# Altium project Proto_buttons.PrjPcb
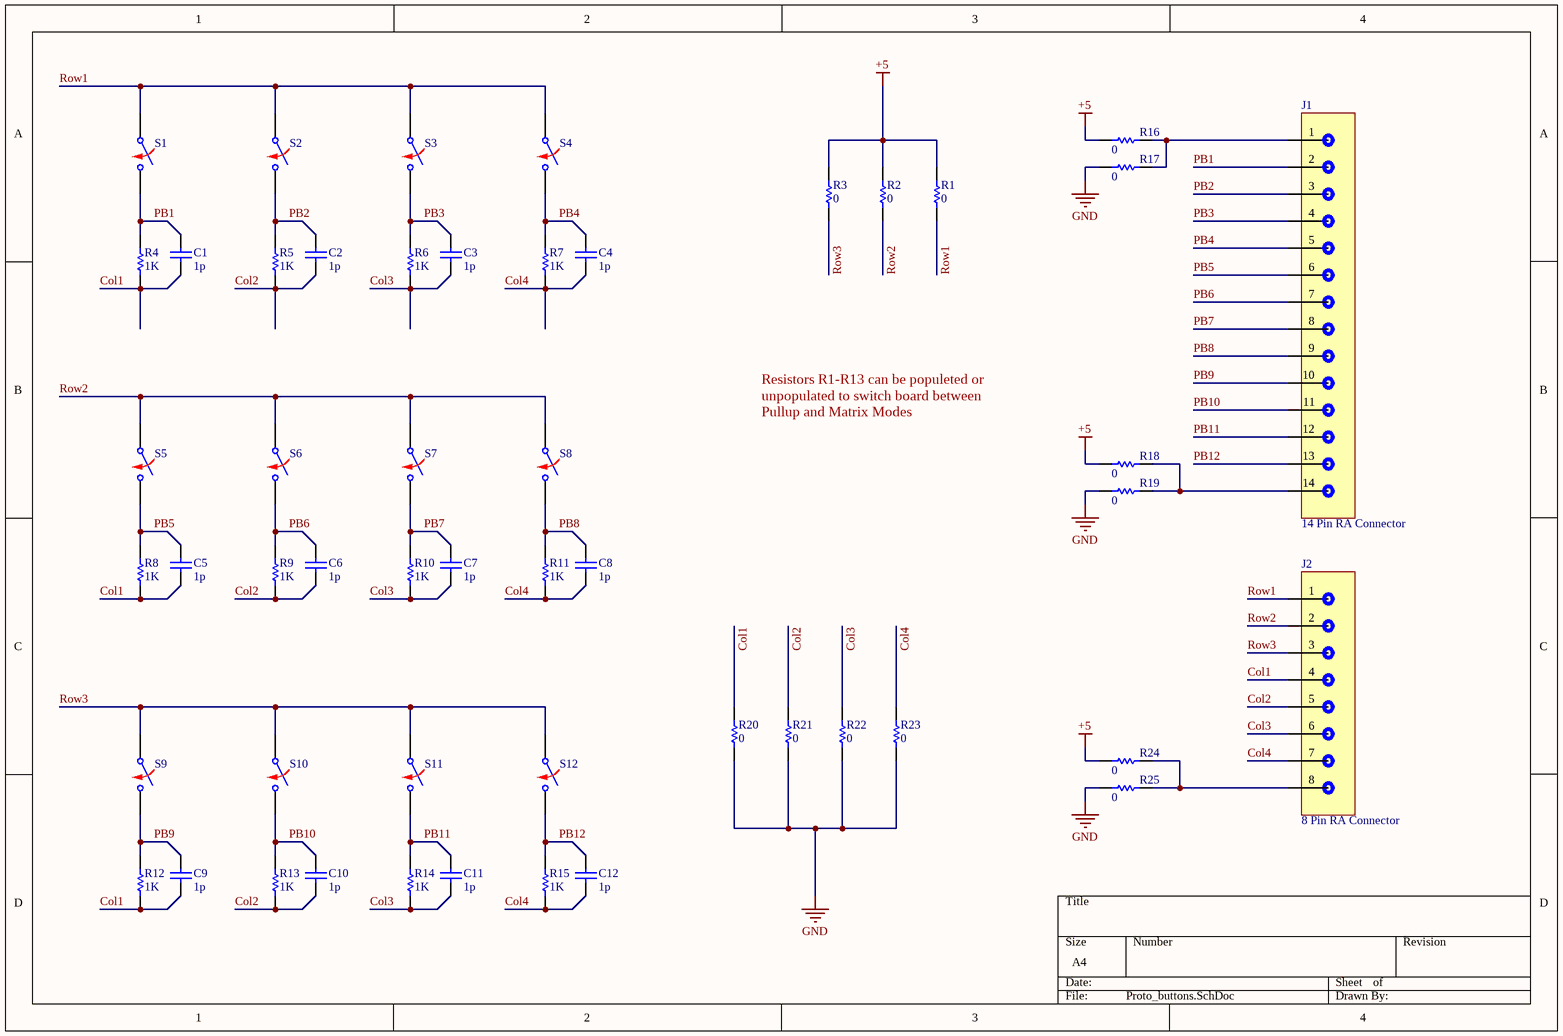
[diagram p0: Proto_buttons.SchDoc]
1 sheet, 51 parts. Net scope: global (net labels, ports and power ports of the same name join across sheets).
Board file: Proto_buttons.PcbDoc

## Sheet Proto_buttons.SchDoc
size A4; SheetNumber: 1; SheetTotal: 1

### Parts
C1  value 1p  [TDK_CC0603_N]  (hidden comment: Capacitor)
C2  value 1p  [TDK_CC0603_N]  (hidden comment: Capacitor)
C3  value 1p  [TDK_CC0603_N]  (hidden comment: Capacitor)
C4  value 1p  [TDK_CC0603_N]  (hidden comment: Capacitor)
C5  value 1p  [TDK_CC0603_N]  (hidden comment: Capacitor)
C6  value 1p  [TDK_CC0603_N]  (hidden comment: Capacitor)
C7  value 1p  [TDK_CC0603_N]  (hidden comment: Capacitor)
C8  value 1p  [TDK_CC0603_N]  (hidden comment: Capacitor)
C9  value 1p  [TDK_CC0603_N]  (hidden comment: Capacitor)
C10  value 1p  [TDK_CC0603_N]  (hidden comment: Capacitor)
C11  value 1p  [TDK_CC0603_N]  (hidden comment: Capacitor)
C12  value 1p  [TDK_CC0603_N]  (hidden comment: Capacitor)
J1  14 Pin RA Connector  [14pin-Edge Connector]
J2  8 Pin RA Connector  [8pin-Edge Connector]
R1  value 0  [Yageo_0603]  (hidden comment: Resistor)
R2  value 0  [Yageo_0603]  (hidden comment: Resistor)
R3  value 0  [Yageo_0603]  (hidden comment: Resistor)
R4  value 1K  [Yageo_0603]  (hidden comment: Resistor)
R5  value 1K  [Yageo_0603]  (hidden comment: Resistor)
R6  value 1K  [Yageo_0603]  (hidden comment: Resistor)
R7  value 1K  [Yageo_0603]  (hidden comment: Resistor)
R8  value 1K  [Yageo_0603]  (hidden comment: Resistor)
R9  value 1K  [Yageo_0603]  (hidden comment: Resistor)
R10  value 1K  [Yageo_0603]  (hidden comment: Resistor)
R11  value 1K  [Yageo_0603]  (hidden comment: Resistor)
R12  value 1K  [Yageo_0603]  (hidden comment: Resistor)
R13  value 1K  [Yageo_0603]  (hidden comment: Resistor)
R14  value 1K  [Yageo_0603]  (hidden comment: Resistor)
R15  value 1K  [Yageo_0603]  (hidden comment: Resistor)
R16  value 0  [Yageo_0603]  (hidden comment: Resistor)
R17  value 0  [Yageo_0603]  (hidden comment: Resistor)
R18  value 0  [Yageo_0603]  (hidden comment: Resistor)
R19  value 0  [Yageo_0603]  (hidden comment: Resistor)
R20  value 0  [Yageo_0603]  (hidden comment: Resistor)
R21  value 0  [Yageo_0603]  (hidden comment: Resistor)
R22  value 0  [Yageo_0603]  (hidden comment: Resistor)
R23  value 0  [Yageo_0603]  (hidden comment: Resistor)
R24  value 0  [Yageo_0603]  (hidden comment: Resistor)
R25  value 0  [Yageo_0603]  (hidden comment: Resistor)
S1  Switch Normally Opened  [SW_SWT0310-043016GSA_REVA]  (value not drawn)
S2  Switch Normally Opened  [SW_SWT0310-043016GSA_REVA]  (value not drawn)
S3  Switch Normally Opened  [SW_SWT0310-043016GSA_REVA]  (value not drawn)
S4  Switch Normally Opened  [SW_SWT0310-043016GSA_REVA]  (value not drawn)
S5  Switch Normally Opened  [SW_SWT0310-043016GSA_REVA]  (value not drawn)
S6  Switch Normally Opened  [SW_SWT0310-043016GSA_REVA]  (value not drawn)
S7  Switch Normally Opened  [SW_SWT0310-043016GSA_REVA]  (value not drawn)
S8  Switch Normally Opened  [SW_SWT0310-043016GSA_REVA]  (value not drawn)
S9  Switch Normally Opened  [SW_SWT0310-043016GSA_REVA]  (value not drawn)
S10  Switch Normally Opened  [SW_SWT0310-043016GSA_REVA]  (value not drawn)
S11  Switch Normally Opened  [SW_SWT0310-043016GSA_REVA]  (value not drawn)
S12  Switch Normally Opened  [SW_SWT0310-043016GSA_REVA]  (value not drawn)

### Nets
+5: R1.1 R2.1 R3.1 R16.2 R18.1 R24.1
GND: R17.1 R19.1 R20.2 R21.2 R22.2 R23.2 R25.1
Col1: C1.1 C5.1 C9.1 J2.4 R4.2 R8.2 R12.2 R20.1
Col2: C2.1 C6.1 C10.1 J2.5 R5.2 R9.2 R13.2 R21.1
Col3: C3.1 C7.1 C11.1 J2.6 R6.2 R10.2 R14.2 R22.1
Col4: C4.1 C8.1 C12.1 J2.7 R7.2 R11.2 R15.2 R23.1
PB1: C1.2 J1.2 R4.1 S1.2
PB2: C2.2 J1.3 R5.1 S2.2
PB3: C3.2 J1.4 R6.1 S3.2
PB4: C4.2 J1.5 R7.1 S4.2
PB5: C5.2 J1.6 R8.1 S5.2
PB6: C6.2 J1.7 R9.1 S6.2
PB7: C7.2 J1.8 R10.1 S7.2
PB8: C8.2 J1.9 R11.1 S8.2
PB9: C9.2 J1.10 R12.1 S9.2
PB10: C10.2 J1.11 R13.1 S10.2
PB11: C11.2 J1.12 R14.1 S11.2
PB12: C12.2 J1.13 R15.1 S12.2
Row1: J2.1 R1.2 S1.1 S2.1 S3.1 S4.1
Row2: J2.2 R2.2 S5.1 S6.1 S7.1 S8.1
Row3: J2.3 R3.2 S9.1 S10.1 S11.1 S12.1
NetJ1_1: J1.1 R16.1 R17.2
NetJ1_14: J1.14 R18.2 R19.2
NetJ2_8: J2.8 R24.2 R25.2

### Notes on the sheet
- Resistors R1-R13 can be populeted or unpopulated to switch board between Pullup and Matrix Modes

### Library data of the parts
C1-C12 = Capacitor: SimulationGenericComponent: True
R1-R3 R16-R25 = Resistor: SimulationGenericComponent: True; TC1: 0; TC2: 0
R4-R15 = Resistor: TC1: 0; SimulationGenericComponent: True; TC2: 0
S1-S12 = SW NO: closed: 0; Rclosed: 1m; Ropen: 1Meg; SimulationGenericComponent: True
J1 = 14 Pin RA Connector: Supplier 1: DigiKey; Supplier Part Number 1: 2073-SWT0310-043016GSACT-ND

## Assembly variants
Matrix Mode: not fitted C1 C2 C3 C4 C5 C6 C7 C8 C9 C10 C11 C12 J2 R2 R3 R4 R5 R6 R7 R8 R9 R10 R11 R12 R13
PU Mode: all parts fitted